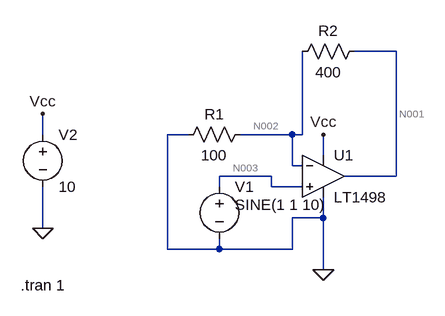
[diagram p0: schematic ampinverseur.asc]
ampinverseur.asc, the LTspice schematic file:
Version 4
SHEET 1 880 680
WIRE 416 -32 352 -32
WIRE -128 96 -128 64
WIRE 96 96 64 96
WIRE 256 96 176 96
WIRE 272 96 272 -32
WIRE 272 96 256 96
WIRE 304 128 304 96
WIRE 256 144 256 96
WIRE 272 144 256 144
WIRE 224 160 144 160
WIRE 416 160 416 -32
WIRE 416 160 336 160
WIRE 144 176 144 160
WIRE 224 176 224 160
WIRE 272 176 224 176
WIRE 304 224 304 192
WIRE 304 224 256 224
WIRE -128 240 -128 176
WIRE 64 272 64 96
WIRE 144 272 144 256
WIRE 144 272 64 272
WIRE 256 272 256 224
WIRE 256 272 144 272
WIRE 304 304 304 224
FLAG 304 304 0
FLAG 304 96 Vcc
FLAG -128 64 Vcc
FLAG -128 240 0
SYMBOL voltage 144 160 R0
WINDOW 3 24 44 Left 2
WINDOW 123 0 0 Left 0
WINDOW 39 0 0 Left 0
SYMATTR InstName V1
SYMATTR Value SINE(1 1 10)
SYMBOL res 192 80 R90
WINDOW 0 0 56 VBottom 2
WINDOW 3 32 56 VTop 2
SYMATTR InstName R1
SYMATTR Value 100
SYMBOL res 368 -48 R90
WINDOW 0 0 56 VBottom 2
WINDOW 3 32 56 VTop 2
SYMATTR InstName R2
SYMATTR Value 400
SYMBOL voltage -128 80 R0
WINDOW 123 0 0 Left 0
WINDOW 39 0 0 Left 0
SYMATTR InstName V2
SYMATTR Value 10
SYMBOL OpAmps\\LT1498 304 96 R0
SYMATTR InstName U1
TEXT -162 328 Left 2 !.tran 1

The netlist it stands for:
* ampinverseur.asc
V1 N003 0 SINE(1 1 10)
R1 N002 0 100
R2 N001 N002 400
V2 Vcc 0 10
XU1 N003 N002 Vcc 0 N001 LT1498  ; pins In+ In- V+ V- OUT
.tran 1
.lib LTC.lib
.backanno
.end

* Results of the author's LTspice run, read from the files saved beside the schematic
* Operating Point, zero values left out:
*   V(n003) = 1 V
*   V(n002) = 1 V
*   V(n001) = 5 V
*   V(vcc) = 10 V
*   I(R2) = 10 mA
*   I(R1) = 10 mA
*   I(V2) = -10.85 mA
*   I(V1) = 258.4 nA
*   Ix(u1:1) = -258.4 nA
*   Ix(u1:2) = -258.4 nA
*   Ix(u1:3) = 10.85 mA
*   Ix(u1:4) = -851.3 µA
*   Ix(u1:5) = -10 mA
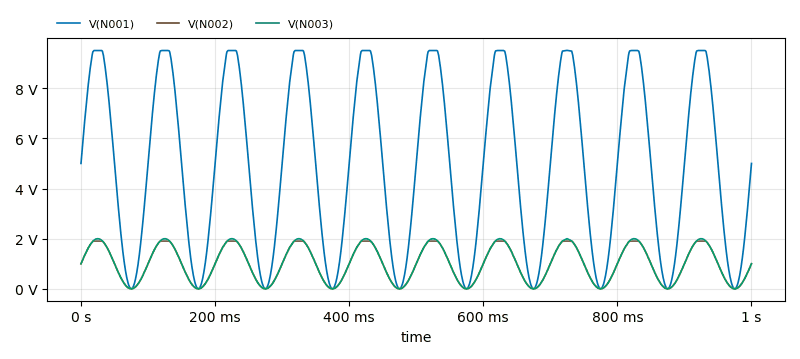
[diagram p1: Transient Analysis of ampinverseur.asc, plotted from the saved traces]
* Transient Analysis, 1 run:
*   V(N001): min 108.9 µV, max 9.51 V, average 4.948 V, rms 6.051 V, last 5 V
*   V(N002): min 42.63 µV, max 1.902 V, average 989.7 mV, rms 1.21 V, last 1 V
*   V(N003): min 0 V, max 2 V, average 998.8 mV, rms 1.225 V, last 1 V